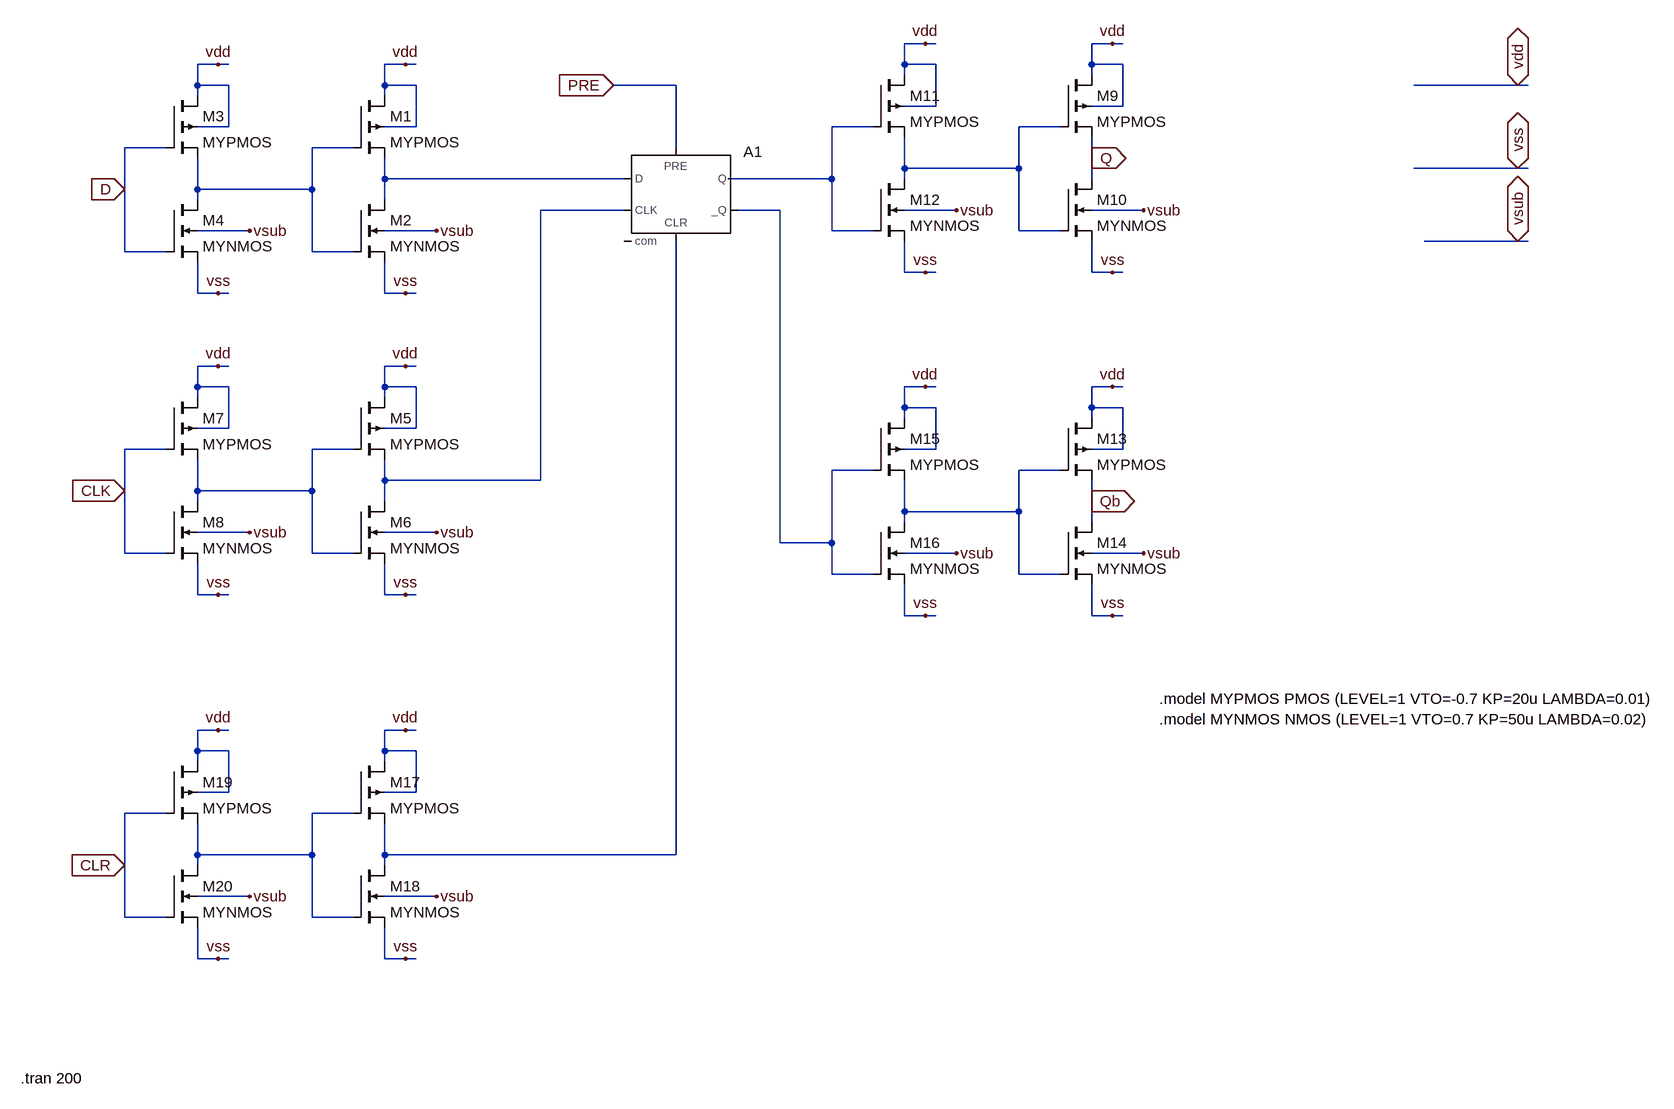
[diagram p0: schematic dsproj_dff.asc]
dsproj_dff.asc, the LTspice schematic file:
Version 4.1
SHEET 1 1348 1480
WIRE 80 -128 48 -128
WIRE 96 -128 80 -128
WIRE 368 -128 336 -128
WIRE 384 -128 368 -128
WIRE -1008 -96 -1040 -96
WIRE -992 -96 -1008 -96
WIRE -720 -96 -752 -96
WIRE -704 -96 -720 -96
WIRE 48 -96 48 -128
WIRE 96 -96 48 -96
WIRE 336 -96 336 -128
WIRE 384 -96 336 -96
WIRE 48 -80 48 -96
WIRE 336 -80 336 -96
WIRE -1040 -64 -1040 -96
WIRE -992 -64 -1040 -64
WIRE -752 -64 -752 -96
WIRE -704 -64 -752 -64
WIRE -304 -64 -400 -64
WIRE 992 -64 832 -64
WIRE 1008 -64 992 -64
WIRE -1040 -48 -1040 -64
WIRE -752 -48 -752 -64
WIRE 96 -32 96 -96
WIRE 96 -32 48 -32
WIRE 384 -32 384 -96
WIRE 384 -32 336 -32
WIRE -992 0 -992 -64
WIRE -992 0 -1040 0
WIRE -704 0 -704 -64
WIRE -704 0 -752 0
WIRE 0 0 -64 0
WIRE 288 0 224 0
WIRE -1088 32 -1152 32
WIRE -800 32 -864 32
WIRE -304 32 -304 -64
WIRE 336 48 336 16
WIRE 48 64 48 16
WIRE 224 64 224 0
WIRE 224 64 48 64
WIRE 992 64 832 64
WIRE 1008 64 992 64
WIRE -752 80 -752 48
WIRE -384 80 -752 80
WIRE -64 80 -64 0
WIRE -64 80 -224 80
WIRE 48 80 48 64
WIRE 336 80 336 48
WIRE -1152 96 -1152 32
WIRE -1040 96 -1040 48
WIRE -864 96 -864 32
WIRE -864 96 -1040 96
WIRE -1040 112 -1040 96
WIRE -752 112 -752 80
WIRE -384 128 -512 128
WIRE -144 128 -208 128
WIRE 128 128 48 128
WIRE 416 128 336 128
WIRE -960 160 -1040 160
WIRE -672 160 -752 160
WIRE -64 160 -64 80
WIRE 0 160 -64 160
WIRE 224 160 224 64
WIRE 288 160 224 160
WIRE 992 176 848 176
WIRE 1008 176 992 176
WIRE -1152 192 -1152 96
WIRE -1088 192 -1152 192
WIRE -864 192 -864 96
WIRE -800 192 -864 192
WIRE 48 224 48 176
WIRE 80 224 48 224
WIRE 96 224 80 224
WIRE 336 224 336 176
WIRE 368 224 336 224
WIRE 384 224 368 224
WIRE -1040 256 -1040 208
WIRE -1008 256 -1040 256
WIRE -992 256 -1008 256
WIRE -752 256 -752 208
WIRE -720 256 -752 256
WIRE -704 256 -720 256
WIRE -1008 368 -1040 368
WIRE -992 368 -1008 368
WIRE -720 368 -752 368
WIRE -704 368 -720 368
WIRE -1040 400 -1040 368
WIRE -992 400 -1040 400
WIRE -752 400 -752 368
WIRE -704 400 -752 400
WIRE 80 400 48 400
WIRE 96 400 80 400
WIRE 368 400 336 400
WIRE 384 400 368 400
WIRE -1040 416 -1040 400
WIRE -752 416 -752 400
WIRE 48 432 48 400
WIRE 96 432 48 432
WIRE 336 432 336 400
WIRE 384 432 336 432
WIRE 48 448 48 432
WIRE 336 448 336 432
WIRE -992 464 -992 400
WIRE -992 464 -1040 464
WIRE -704 464 -704 400
WIRE -704 464 -752 464
WIRE -1088 496 -1152 496
WIRE -800 496 -864 496
WIRE 96 496 96 432
WIRE 96 496 48 496
WIRE 384 496 384 432
WIRE 384 496 336 496
WIRE 0 528 -64 528
WIRE 288 528 224 528
WIRE -752 544 -752 512
WIRE -512 544 -512 128
WIRE -512 544 -752 544
WIRE -1152 560 -1152 496
WIRE -1040 560 -1040 512
WIRE -864 560 -864 496
WIRE -864 560 -1040 560
WIRE -1040 576 -1040 560
WIRE -752 576 -752 544
WIRE 336 576 336 544
WIRE 48 592 48 544
WIRE 224 592 224 528
WIRE 224 592 48 592
WIRE 48 608 48 592
WIRE 336 608 336 576
WIRE -960 624 -1040 624
WIRE -672 624 -752 624
WIRE -144 640 -144 128
WIRE -64 640 -64 528
WIRE -64 640 -144 640
WIRE -1152 656 -1152 560
WIRE -1088 656 -1152 656
WIRE -864 656 -864 560
WIRE -800 656 -864 656
WIRE 128 656 48 656
WIRE 416 656 336 656
WIRE -64 688 -64 640
WIRE 0 688 -64 688
WIRE 224 688 224 592
WIRE 288 688 224 688
WIRE -1040 720 -1040 672
WIRE -1008 720 -1040 720
WIRE -992 720 -1008 720
WIRE -752 720 -752 672
WIRE -720 720 -752 720
WIRE -704 720 -720 720
WIRE 48 752 48 704
WIRE 80 752 48 752
WIRE 96 752 80 752
WIRE 336 752 336 704
WIRE 368 752 336 752
WIRE 384 752 368 752
WIRE -1008 928 -1040 928
WIRE -992 928 -1008 928
WIRE -720 928 -752 928
WIRE -704 928 -720 928
WIRE -1040 960 -1040 928
WIRE -992 960 -1040 960
WIRE -752 960 -752 928
WIRE -704 960 -752 960
WIRE -1040 976 -1040 960
WIRE -752 976 -752 960
WIRE -992 1024 -992 960
WIRE -992 1024 -1040 1024
WIRE -704 1024 -704 960
WIRE -704 1024 -752 1024
WIRE -1088 1056 -1152 1056
WIRE -800 1056 -864 1056
WIRE -1040 1120 -1040 1072
WIRE -864 1120 -864 1056
WIRE -864 1120 -1040 1120
WIRE -752 1120 -752 1072
WIRE -304 1120 -304 176
WIRE -304 1120 -752 1120
WIRE -1152 1136 -1152 1056
WIRE -1040 1136 -1040 1120
WIRE -752 1136 -752 1120
WIRE -960 1184 -1040 1184
WIRE -672 1184 -752 1184
WIRE -1152 1216 -1152 1136
WIRE -1088 1216 -1152 1216
WIRE -864 1216 -864 1120
WIRE -800 1216 -864 1216
WIRE -1040 1280 -1040 1232
WIRE -1008 1280 -1040 1280
WIRE -992 1280 -1008 1280
WIRE -752 1280 -752 1232
WIRE -720 1280 -752 1280
WIRE -704 1280 -720 1280
FLAG -1008 -96 vdd
FLAG -720 -96 vdd
FLAG -1008 256 vss
FLAG -720 256 vss
FLAG -960 160 vsub
FLAG -672 160 vsub
FLAG -1152 96 D
IOPIN -1152 96 In
FLAG -1008 368 vdd
FLAG -720 368 vdd
FLAG -1008 720 vss
FLAG -720 720 vss
FLAG -960 624 vsub
FLAG -672 624 vsub
FLAG -1152 560 CLK
IOPIN -1152 560 In
FLAG -400 -64 PRE
IOPIN -400 -64 In
FLAG 80 -128 vdd
FLAG 368 -128 vdd
FLAG 80 224 vss
FLAG 368 224 vss
FLAG 128 128 vsub
FLAG 416 128 vsub
FLAG 336 48 Q
IOPIN 336 48 Out
FLAG 80 400 vdd
FLAG 368 400 vdd
FLAG 80 752 vss
FLAG 368 752 vss
FLAG 128 656 vsub
FLAG 416 656 vsub
FLAG 336 576 Qb
IOPIN 336 576 Out
FLAG -1008 928 vdd
FLAG -720 928 vdd
FLAG -1008 1280 vss
FLAG -720 1280 vss
FLAG -960 1184 vsub
FLAG -672 1184 vsub
FLAG -1152 1136 CLR
IOPIN -1152 1136 In
FLAG 992 -64 vdd
IOPIN 992 -64 BiDir
FLAG 992 64 vss
IOPIN 992 64 BiDir
FLAG 992 176 vsub
IOPIN 992 176 BiDir
SYMBOL Digital\\dflop -304 32 R0
SYMATTR InstName A1
SYMBOL pmos4 -800 -48 R0
SYMATTR InstName M1
SYMATTR Value MYPMOS
SYMATTR Value2 l=180e-9 w=2400e-9
SYMBOL nmos4 -800 112 R0
SYMATTR InstName M2
SYMATTR Value MYNMOS
SYMATTR Value2 l=180e-9 w=1200e-9
SYMBOL pmos4 -1088 -48 R0
SYMATTR InstName M3
SYMATTR Value MYPMOS
SYMATTR Value2 l=180e-9 w=2400e-9
SYMBOL nmos4 -1088 112 R0
SYMATTR InstName M4
SYMATTR Value MYNMOS
SYMATTR Value2 l=180e-9 w=1200e-9
SYMBOL pmos4 -800 416 R0
SYMATTR InstName M5
SYMATTR Value MYPMOS
SYMATTR Value2 l=180e-9 w=2400e-9
SYMBOL nmos4 -800 576 R0
SYMATTR InstName M6
SYMATTR Value MYNMOS
SYMATTR Value2 l=180e-9 w=1200e-9
SYMBOL pmos4 -1088 416 R0
SYMATTR InstName M7
SYMATTR Value MYPMOS
SYMATTR Value2 l=180e-9 w=2400e-9
SYMBOL nmos4 -1088 576 R0
SYMATTR InstName M8
SYMATTR Value MYNMOS
SYMATTR Value2 l=180e-9 w=1200e-9
SYMBOL pmos4 288 -80 R0
SYMATTR InstName M9
SYMATTR Value MYPMOS
SYMATTR Value2 l=180e-9 w=2400e-9
SYMBOL nmos4 288 80 R0
SYMATTR InstName M10
SYMATTR Value MYNMOS
SYMATTR Value2 l=180e-9 w=1200e-9
SYMBOL pmos4 0 -80 R0
SYMATTR InstName M11
SYMATTR Value MYPMOS
SYMATTR Value2 l=180e-9 w=2400e-9
SYMBOL nmos4 0 80 R0
SYMATTR InstName M12
SYMATTR Value MYNMOS
SYMATTR Value2 l=180e-9 w=1200e-9
SYMBOL pmos4 288 448 R0
SYMATTR InstName M13
SYMATTR Value MYPMOS
SYMATTR Value2 l=180e-9 w=2400e-9
SYMBOL nmos4 288 608 R0
SYMATTR InstName M14
SYMATTR Value MYNMOS
SYMATTR Value2 l=180e-9 w=1200e-9
SYMBOL pmos4 0 448 R0
SYMATTR InstName M15
SYMATTR Value MYPMOS
SYMATTR Value2 l=180e-9 w=2400e-9
SYMBOL nmos4 0 608 R0
SYMATTR InstName M16
SYMATTR Value MYNMOS
SYMATTR Value2 l=180e-9 w=1200e-9
SYMBOL pmos4 -800 976 R0
SYMATTR InstName M17
SYMATTR Value MYPMOS
SYMATTR Value2 l=180e-9 w=2400e-9
SYMBOL nmos4 -800 1136 R0
SYMATTR InstName M18
SYMATTR Value MYNMOS
SYMATTR Value2 l=180e-9 w=1200e-9
SYMBOL pmos4 -1088 976 R0
SYMATTR InstName M19
SYMATTR Value MYPMOS
SYMATTR Value2 l=180e-9 w=2400e-9
SYMBOL nmos4 -1088 1136 R0
SYMATTR InstName M20
SYMATTR Value MYNMOS
SYMATTR Value2 l=180e-9 w=1200e-9
TEXT -1312 1464 Left 2 !.tran 200
TEXT 440 880 Left 2 !.model MYPMOS PMOS (LEVEL=1 VTO=-0.7 KP=20u LAMBDA=0.01)\n.model MYNMOS NMOS (LEVEL=1 VTO=0.7 KP=50u LAMBDA=0.02)

The netlist it stands for:
* dsproj_dff.asc
A1 N004 0 N005 PRE N010 N006 N001 0 DFLOP
M1 vdd N003 N004 vdd MYPMOS l=180e-9 w=2400e-9
M2 N004 N003 vss vsub MYNMOS l=180e-9 w=1200e-9
M3 vdd D N003 vdd MYPMOS l=180e-9 w=2400e-9
M4 N003 D vss vsub MYNMOS l=180e-9 w=1200e-9
M5 vdd N007 N005 vdd MYPMOS l=180e-9 w=2400e-9
M6 N005 N007 vss vsub MYNMOS l=180e-9 w=1200e-9
M7 vdd CLK N007 vdd MYPMOS l=180e-9 w=2400e-9
M8 N007 CLK vss vsub MYNMOS l=180e-9 w=1200e-9
M9 vdd N002 Q vdd MYPMOS l=180e-9 w=2400e-9
M10 Q N002 vss vsub MYNMOS l=180e-9 w=1200e-9
M11 vdd N001 N002 vdd MYPMOS l=180e-9 w=2400e-9
M12 N002 N001 vss vsub MYNMOS l=180e-9 w=1200e-9
M13 vdd N008 Qb vdd MYPMOS l=180e-9 w=2400e-9
M14 Qb N008 vss vsub MYNMOS l=180e-9 w=1200e-9
M15 vdd N006 N008 vdd MYPMOS l=180e-9 w=2400e-9
M16 N008 N006 vss vsub MYNMOS l=180e-9 w=1200e-9
M17 vdd N009 N010 vdd MYPMOS l=180e-9 w=2400e-9
M18 N010 N009 vss vsub MYNMOS l=180e-9 w=1200e-9
M19 vdd CLR N009 vdd MYPMOS l=180e-9 w=2400e-9
M20 N009 CLR vss vsub MYNMOS l=180e-9 w=1200e-9
.model NMOS NMOS
.model PMOS PMOS
.lib standard.mos
.tran 200
.model MYPMOS PMOS (LEVEL=1 VTO=-0.7 KP=20u LAMBDA=0.01)
.model MYNMOS NMOS (LEVEL=1 VTO=0.7 KP=50u LAMBDA=0.02)
.backanno
.end